# EAGLE design opaq_n1 (EAGLE 6.3)

## Sheet 1 of 2
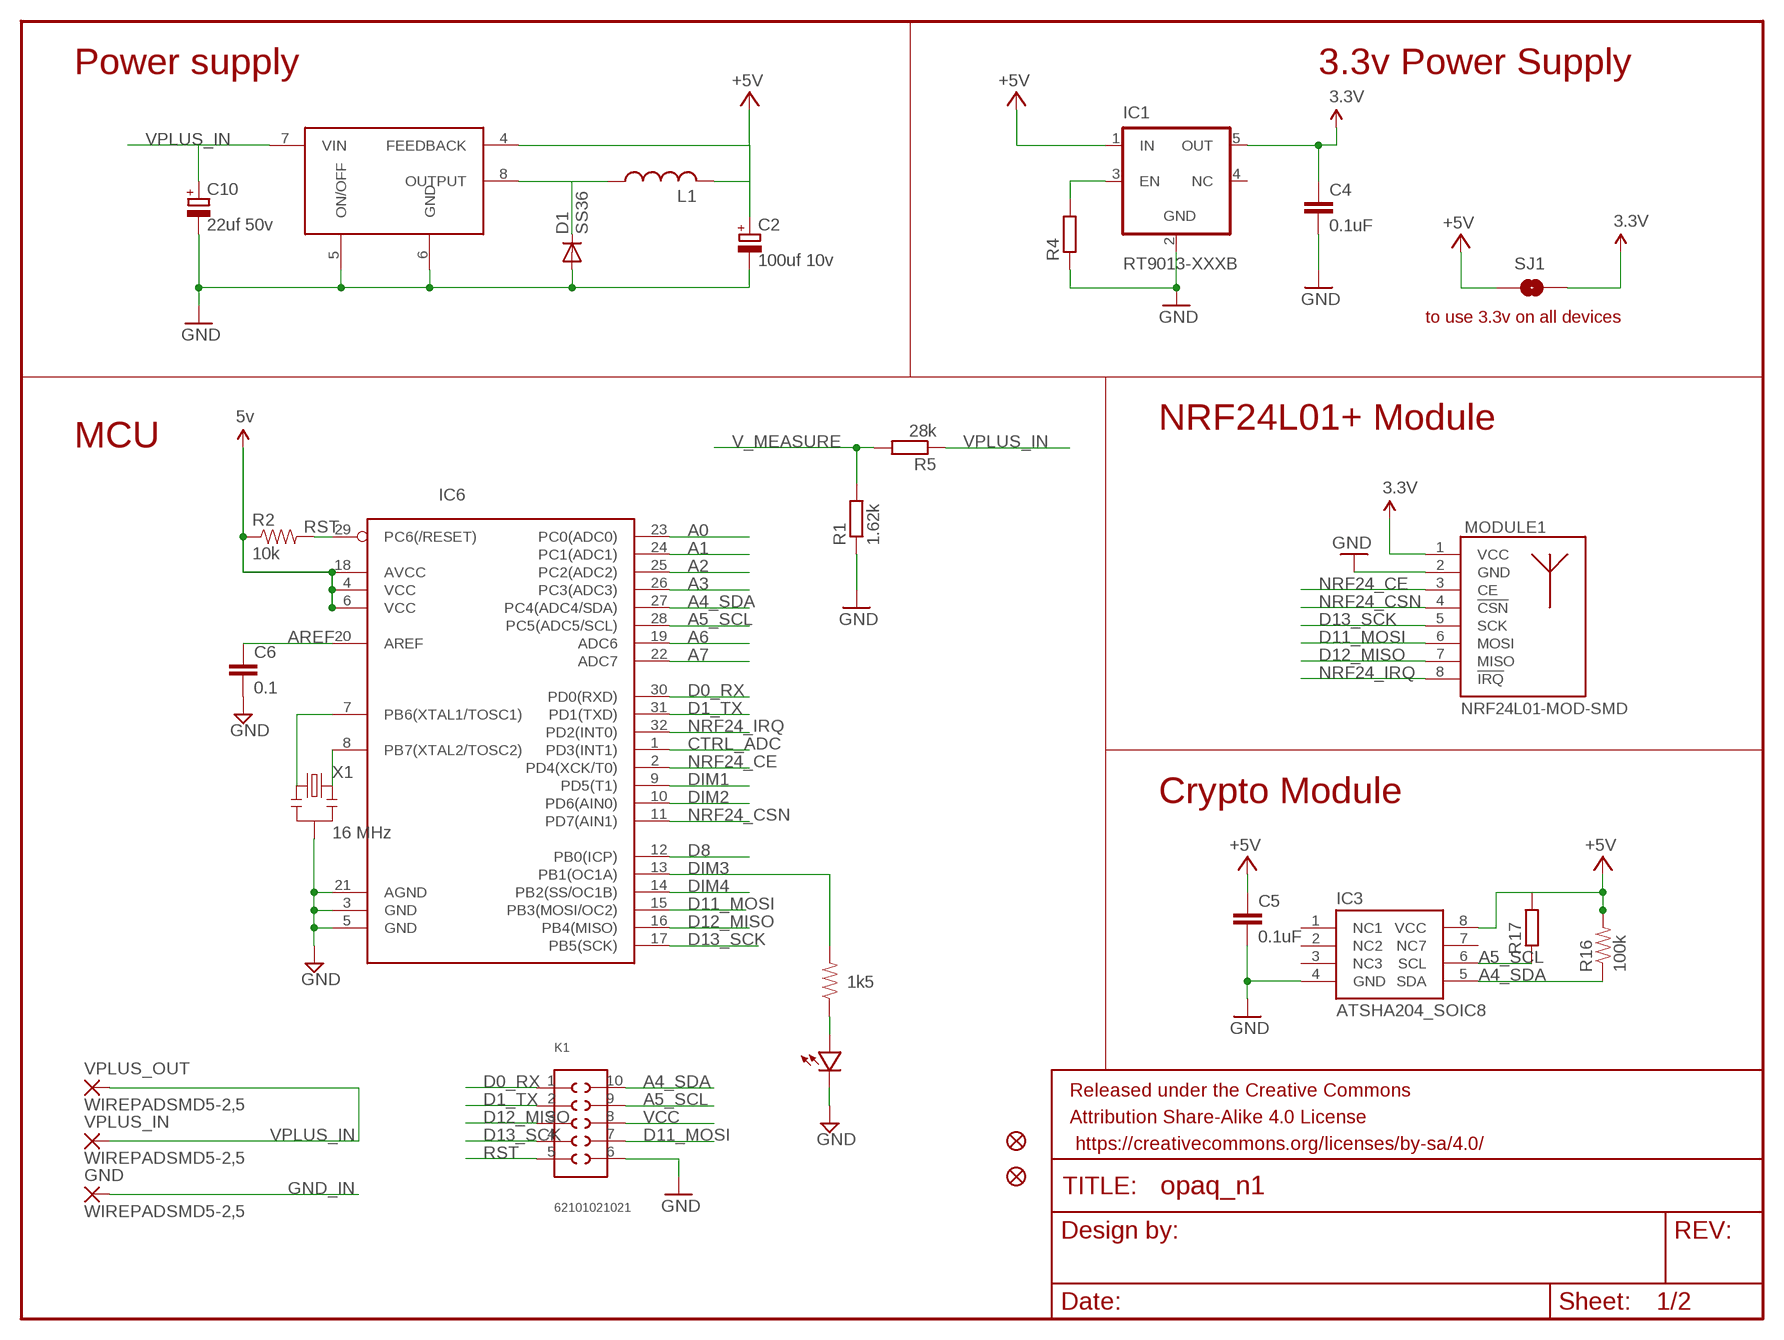
[diagram p0: schematic, sheet 1]

### Parts
C2  100uf 10v  CPOL-EUC/6032-28R  [C/6032-28R]
C4  0.1uF  CAP0805  [0805]
C5  0.1uF  CAP0805  [0805]
C6  0.1  CAP0603-CAP  [0603-CAP]
C10  22uf 50v  CPOL-EUD/7343-31R  [D/7343-31R]
D1  SS36  DIODESMA  [SMA-DIODE]
DIM  LED0603  [0603-LED]
FRAME1  FRAME-LETTER  [CREATIVE_COMMONS]
GND  WIREPADSMD5-2,5  [5-2,5]
IC1  RT9013-XXXB  [SOT23-5]
IC3  ATSHA204_SOIC8  [SOIC8]
IC6  ATMega-328  ATMEGA168/328MLF  [MLF32]
IC8  LM2594HV  LM2594  [SO08]
JP1  FIDUCIAL1X2.5  [FIDUCIAL-1X2.5]
JP2  FIDUCIAL1X2.5  [FIDUCIAL-1X2.5]
K1  62101021021  [62101021021]
L1  NR6045  [2525]
MODULE1  NRF24L01-MOD-SMD  [SMD8-MODULE]
R1  1.62k  R-EU_R0805  [0805]
R2  10k  RESISTOR0603-RES  [0603-RES]
R3  1k5  RESISTOR0603-RES  [0603-RES]
R4  R-EU_R0805  [0805]
R5  28k  R-EU_R0805  [0805]
R16  100k  RESISTOR0805-RES  [0805]
R17  R-EU_R0805  [0805]
SJ1  SOLDERJUMPERTRACE  [SJ_2S-TRACE]
VPLUS_IN  WIREPADSMD5-2,5  [5-2,5]
VPLUS_OUT  WIREPADSMD5-2,5  [5-2,5]
X1  16 MHz  RESONATORSMD  [RESONATOR-SMD]

### Nets
3.3V: C4.1 IC1.5(OUT) MODULE1.1(VCC) SJ1.2
+5V [power usb]: C2.+ C5.1 IC1.1(IN) IC3.8(VCC) IC8.4(FEEDBACK) L1.P$1 R16.2 R17.2 SJ1.1 ; also sheet 2
A0: IC6.23(PC0(ADC0))
A1: IC6.24(PC1(ADC1))
A2: IC6.25(PC2(ADC2))
A3: IC6.26(PC3(ADC3))
A4_SDA: IC3.5(SDA) IC6.27(PC4(ADC4/SDA)) K1.10 R16.1 ; also sheet 2
A5_SCL: IC3.6(SCL) IC6.28(PC5(ADC5/SCL)) K1.9 R17.1 ; also sheet 2
A6: IC6.19(ADC6)
A7: IC6.22(ADC7)
AREF: C6.1 IC6.20(AREF)
CTRL_ADC: IC6.1(PD3(INT1)) ; also sheet 2
D0_RX: IC6.30(PD0(RXD)) K1.1
D1_TX: IC6.31(PD1(TXD)) K1.2
D8: IC6.12(PB0(ICP)) ; also sheet 2
D11_MOSI: IC6.15(PB3(MOSI/OC2)) K1.7 MODULE1.6(MOSI) ; also sheet 2
D12_MISO: IC6.16(PB4(MISO)) K1.3 MODULE1.7(MISO) ; also sheet 2
D13_SCK: IC6.17(PB5(SCK)) K1.4 MODULE1.5(SCK) ; also sheet 2
DIM1: IC6.9(PD5(T1)) ; also sheet 2
DIM2: IC6.10(PD6(AIN0)) ; also sheet 2
DIM3: IC6.13(PB1(OC1A)) R3.2 ; also sheet 2
DIM4: IC6.14(PB2(SS/OC1B)) ; also sheet 2
GND: C2.- C4.2 C5.2 C6.2 C10.- D1.A DIM.MINUS IC1.2(GND) IC3.4(GND) IC6.3(GND) IC6.5(GND) IC6.21(AGND) IC8.5(ON/OFF) IC8.6(GND) K1.6 MODULE1.2(GND) R1.1 R4.1 X1.2 ; also sheet 2
GND_IN: GND.1(P) ; also sheet 2
N$1: IC6.7(PB6(XTAL1/TOSC1)) X1.1
N$2: DIM.PLUS R3.1
N$10: IC1.3(EN) R4.2
N$17: D1.C IC8.8(OUTPUT) L1.P$2
N$21: IC6.8(PB7(XTAL2/TOSC2)) X1.3
NRF24_CE: IC6.2(PD4(XCK/T0)) MODULE1.3(CE)
NRF24_CSN: IC6.11(PD7(AIN1)) MODULE1.4(!CSN)
NRF24_IRQ: IC6.32(PD2(INT0)) MODULE1.8(!IRQ)
RST: IC6.29(PC6(/RESET)) K1.5 R2.2
V_MEASURE: R1.2 R5.2 ; also sheet 2
VCC: IC6.4(VCC) IC6.6(VCC) IC6.18(AVCC) K1.8 R2.1 ; supply symbol labelled 5v ; also sheet 2
VPLUS_IN [power]: C10.+ IC8.7(VIN) R5.1 VPLUS_IN.1(P) VPLUS_OUT.1(P)
Unconnected: IC1.4(NC) IC3.1(NC1) IC3.2(NC2) IC3.3(NC3) IC3.7(NC7)

### Notes on the sheet
- Power supply | 3.3v Power Supply
- to use 3.3v on all devices
- NRF24L01+ Module
- MCU
- Crypto Module

## Sheet 2 of 2
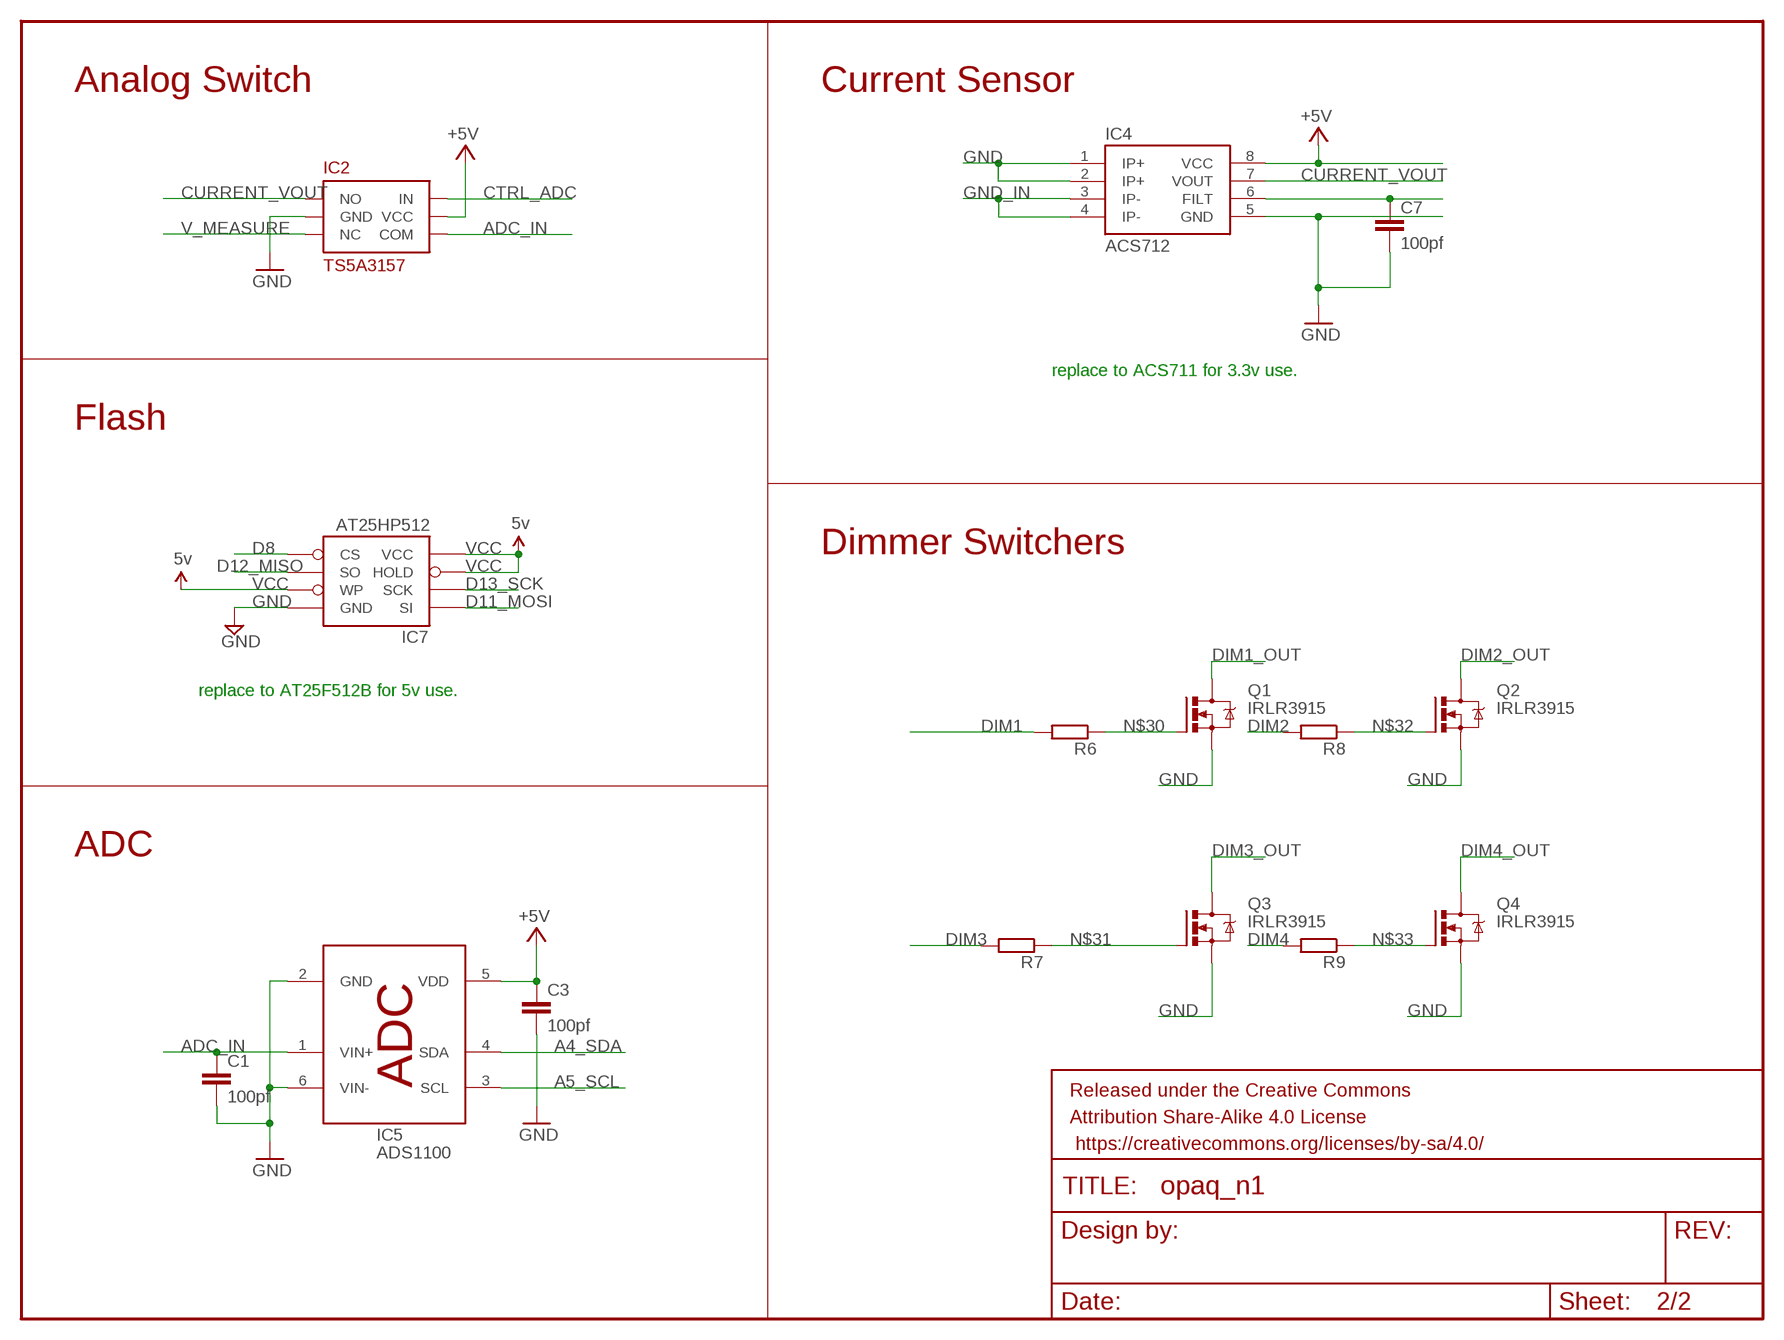
[diagram p1: schematic, sheet 2]

### Parts
C1  100pf  CAP0402-CAP  [0402-CAP]
C3  100pf  CAP0402-CAP  [0402-CAP]
C7  100pf  CAP0402-CAP  [0402-CAP]
FRAME2  FRAME-LETTERNO_PACKAGE  [DUMMY]
IC2  TS5A3157  [SOT23-6]
IC4  ACS712  [SO08]
IC5  ADS1100  [SOT23-6]
IC7  AT25HP512  AT25F512BWIDE_5.3MM  [SO08WIDE]
Q1  IRLR3915  [D-PAK_TO252AA]
Q2  IRLR3915  [D-PAK_TO252AA]
Q3  IRLR3915  [D-PAK_TO252AA]
Q4  IRLR3915  [D-PAK_TO252AA]
R6  R-EU_R0805  [0805]
R7  R-EU_R0805  [0805]
R8  R-EU_R0805  [0805]
R9  R-EU_R0805  [0805]

### Nets
+5V [power usb]: C3.1 IC2.5(VCC) IC4.8(VCC) IC5.5(VDD) ; also sheet 1
A4_SDA: IC5.4(SDA) ; also sheet 1
A5_SCL: IC5.3(SCL) ; also sheet 1
ADC_IN: C1.1 IC2.4(COM) IC5.1(VIN+)
CTRL_ADC: IC2.6(IN) ; also sheet 1
CURRENT_VOUT: IC2.1(NO) IC4.7(VOUT)
D8: IC7.1(CS) ; also sheet 1
D11_MOSI: IC7.5(SI) ; also sheet 1
D12_MISO: IC7.2(SO) ; also sheet 1
D13_SCK: IC7.6(SCK) ; also sheet 1
DIM1: R6.2 ; also sheet 1
DIM1_OUT: Q1.4(D)
DIM2: R8.2 ; also sheet 1
DIM2_OUT: Q2.4(D)
DIM3: R7.2 ; also sheet 1
DIM3_OUT: Q3.4(D)
DIM4: R9.2 ; also sheet 1
DIM4_OUT: Q4.4(D)
FILT: C7.1 IC4.6(FILT)
GND: C1.2 C3.2 C7.2 IC2.2(GND) IC4.1(IP+) IC4.2(IP+) IC4.5(GND) IC5.2(GND) IC5.6(VIN-) IC7.4(GND) Q1.3(S) Q2.3(S) Q3.3(S) Q4.3(S) ; also sheet 1
GND_IN: IC4.3(IP-) IC4.4(IP-) ; also sheet 1
N$30: Q1.1(G) R6.1
N$31: Q3.1(G) R7.1
N$32: Q2.1(G) R8.1
N$33: Q4.1(G) R9.1
V_MEASURE: IC2.3(NC) ; also sheet 1
VCC: IC7.3(WP) IC7.7(HOLD) IC7.8(VCC) ; supply symbol labelled 5v ; also sheet 1

### Notes on the sheet
- Analog Switch | Current Sensor
- replace to ACS711 for 3.3v use.
- Flash
- Dimmer Switchers
- replace to AT25F512B for 5v use.
- ADC

## Library data of the parts
C1 C3-C5 C7 = SparkFun-Passives:CAP: Capacitor Standard 0603 ceramic capacitor, and 0.1" leaded capacitor.
C2 C10 = rcl:CPOL-EU: POLARIZED CAPACITOR, European symbol
C6 = LowPowerLab:CAP: Capacitor Standard 0603 ceramic capacitor, and 0.1" leaded capacitor.
D1 = SparkFun:DIODE: Diode These are standard reverse protection diodes and small signal diodes. SMA package can handle up to about 1A. SOD-323 can handle about 200mA. What the SOD-323 package when ordering, there are some mfgs out there that are 5-pin packages.
DIM = LowPowerLab:LED
FRAME1 = SparkFun-Aesthetics:FRAME-LETTER: Schematic Frame Standard 8.5x11 US Letter frame
FRAME2 = SparkFun-Aesthetics:FRAME-LETTER: Schematic Frame Standard 8.5x11 US Letter frame; DESIGNER: Nobody; VERSION: v01
GND VPLUS_IN VPLUS_OUT = wirepad:WIREPAD: Wire PAD connect wire on PCB
IC1 = v-reg_extra:RT9013-XXX: LDO REGULATOR 500mA, Low Dropout, Low Noise Ultra-Fast without bypass capacitor CMOS LDO Regulator
IC2 = pimoroni:TS5A3157: TS5A3157: 10-Ω SPDT ANALOG SWITCH The TS5A3157 is a single-pole double-throw (SPDT) analog switch that is designed to operate from 1.65V to 5.5V. This device can handle both digital and analog signals, and signals up to V+ can be transmitted in either direction.
IC3 = SparkFun-DigitalIC:ATSHA204_SOIC8: ATSHA204; PROD_ID: IC-11981
IC4 = SparkFun:ACS712
IC5 = bytewerk-analog:ADS1100: 16-Bit ANALOG-TO-DIGITAL CONVERTER, I2C; MF: TI; MPN: ADS1100; OC_MOUSER: 595-ADS1100A1IDBVT
IC6 = LowPowerLab:ATMEGA168/328: Atmel 32-pin 8-bit micro, 16k flash.
IC7 = LowPowerLab:AT25F512B: 4-Mbit SPI flash memory
IC8 = apedro_lib:LM2594: 8-SOIC NMOSFET
JP1 JP2 = SparkFun:FIDUCIAL: Fiducial Alignment Points Various fiducial points for machine vision alignment.
K1 = Wurth_Elektronik_Electromechanic_Board_to_Board_Connectors_rev15c:62101021021: WR-PHD 1.27mm Dual SMT Pin Header H=3.80 mm, 10 Pins=>Code : Con_BTB_PHD_1.27_2_62101021021 <http://katalog.we-online.de/media/thumbs2/eican/thb_Con_BTB_PHD_1.27_2_6210xx21021_pf2.jpg> Details see: http://katalog.we-online.de/en/em/621_0xx_210_21 Created 2014-06-03, Karrer Zheng 2014 (C) Würth Elektronik
L1 = apedro_lib:NR6045
MODULE1 = nrf24l01:NRF24L01-MOD: NRF24L01 based module VCC = 1.9~3.6V
Q1-Q4 = apedro_lib:IRLR3915: N-Channel HEXFET® Power MOSFET Logic Level AUTOMOTIVE MOSFET Source: http://www.irf.com/product-info/datasheets/data/irlz44zpbf.pdf
R1 R4-R9 R17 = resistor:R-EU_: RESISTOR, European symbol
R2 R3 = LowPowerLab:RESISTOR: Resistor Basic schematic elements and footprints for 0603, 1206, and PTH resistors.
R16 = SparkFun-Passives:RESISTOR: Resistor Basic schematic elements and footprints for 0603, 1206, and PTH resistors.
SJ1 = SparkFun:SOLDERJUMPER: Solder Jumper Standard SMD solder jumper. Used to automate production. Two varients : Normally Open and Normally Closed are the same, but have different paste layers. NC will have a large amount of paste and should jumper during reflow.
X1 = SparkFun:RESONATOR: Resonator Small SMD resonator. This is the itty bitty 10/20MHz resonators with built in caps. CSTCE10M0G55 and CSTCE20M0V53. Footprint has been reviewed closely but hasn't been tested yet.

## Net classes
1 power: width 0.381 mm, clearance 0.254 mm
2 gnd: width 0.305 mm, drill 0.406 mm, clearance 0.203 mm
3 power usb: width 0.508 mm, drill 0.406 mm, clearance 0.203 mm

## Board
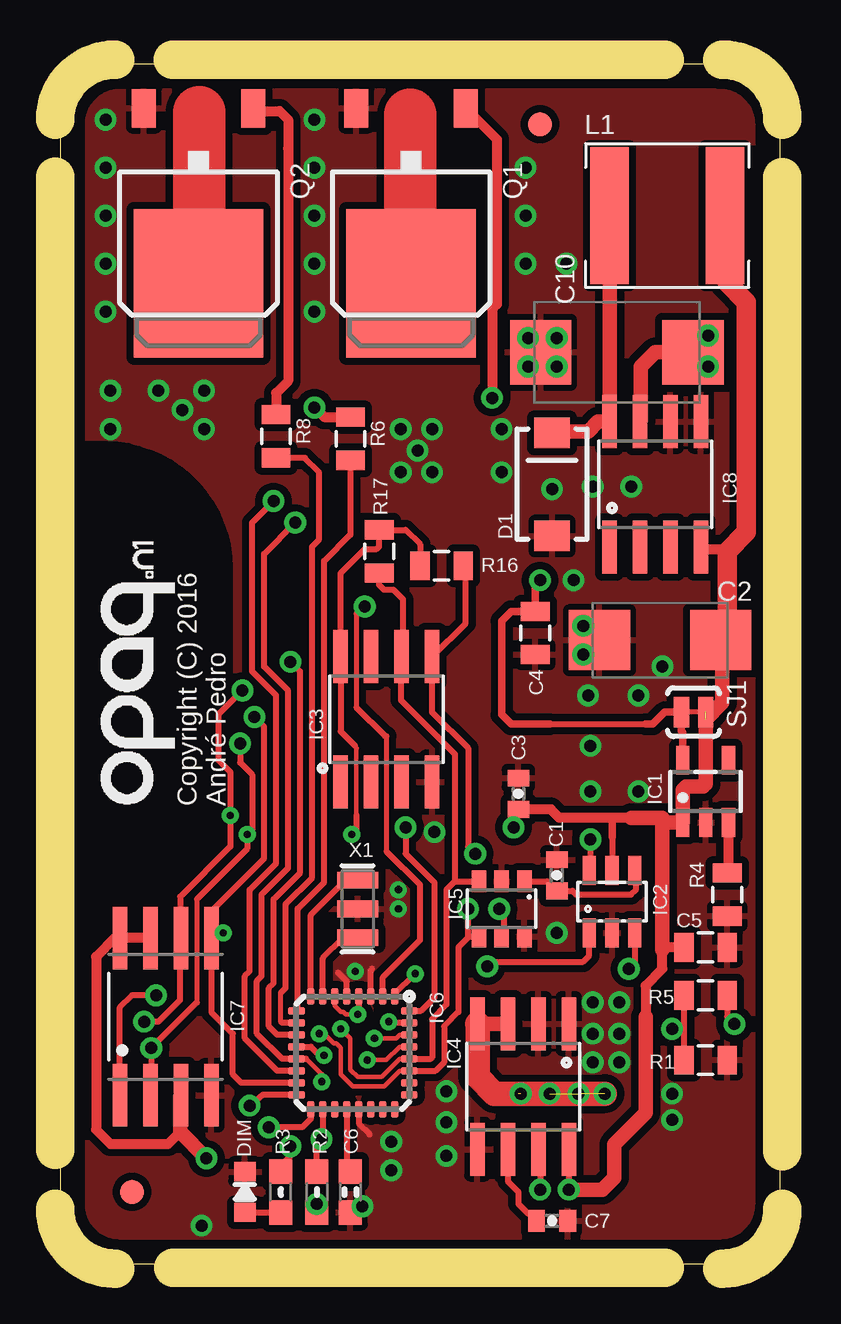
[diagram p2: board, top side]
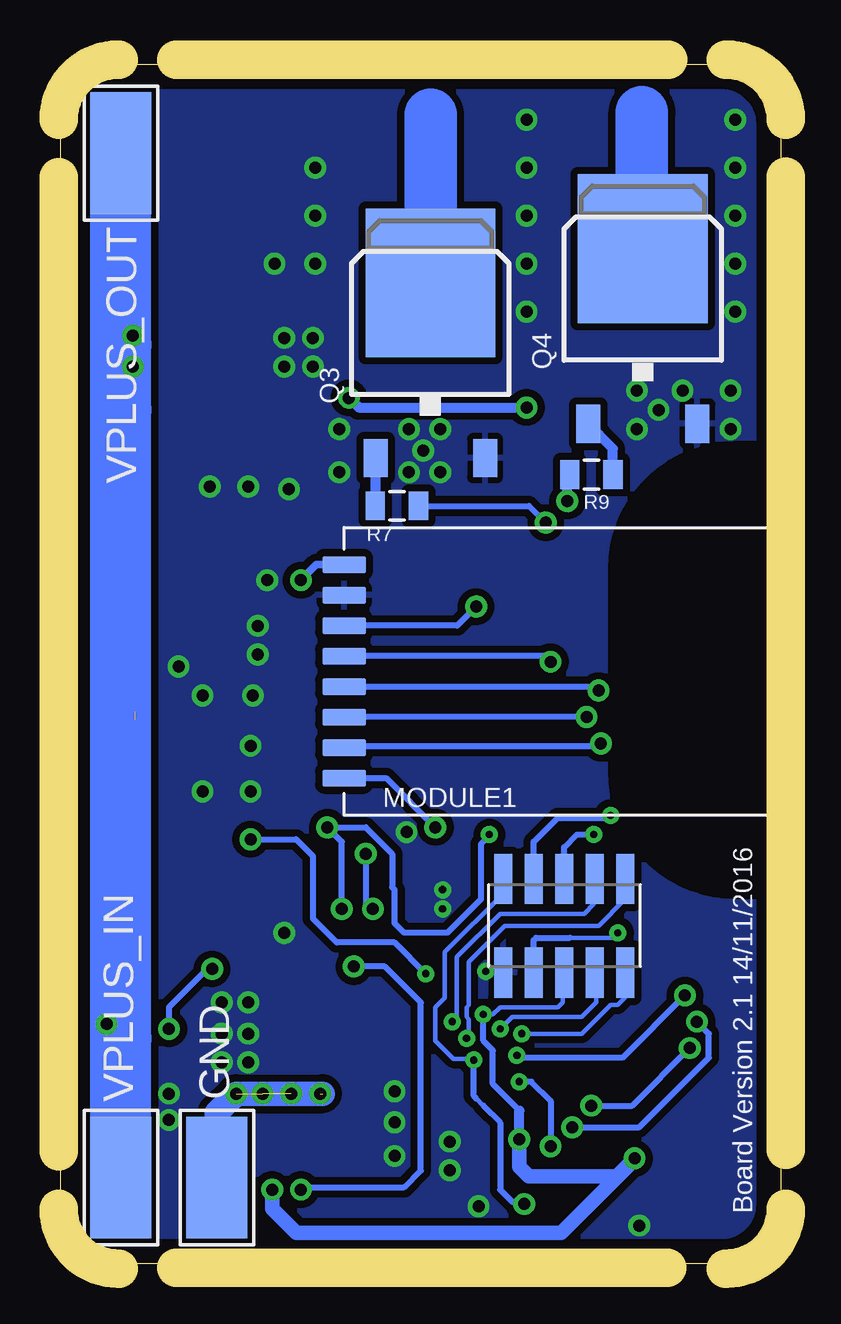
[diagram p3: board, bottom side, seen from below]

Size 30 x 50 mm. Coordinates in mm from the lower left corner, seen from the top.
Outline: 27.5,50 2.5,50 arc90 0,47.5 0,2.5 arc90 2.5,0 27.5,0 arc90 30,2.5 30,47.5 arc90 27.5,50
Copper layers (1*16): Top 0.035mm / dielectric 1.5mm / Bottom 0.035mm
Design rules "default *": minimum track width 10mil, minimum drill 6mil, track to track 7mil, track to pad 7mil, pad to pad 7mil, via to via 7mil, smd to smd 7mil, copper to edge 40mil, drill to drill 8mil, minimum pad ring 10mil, minimum via ring 8mil, stop-mask expansion 4mil, vias tented up to drill 0mil, thermal gap 10mil
tRestrict: area 0,15.5 to 6.9,34
bRestrict: area 0,15.5 to 6.9,34
Milling: 8 lines

### Footprints (pad centres in the part's own frame; a part is rotated, then mirrored left to right if it is on the bottom)
0402-CAP = smd 0.7 x 0.9: 1 -0.65,0; 2 0.65,0
C/6032-28R = smd 2.55 x 2.5: + 2.525,0; - -2.525,0
0805 = smd 0.8 x 1.2: 1 -0.9,0; 2 0.9,0
0603-CAP = smd 1.016 x 0.965: 1 -0.85,0; 2 0.85,0
D/7343-31R = smd 2.55 x 2.7: + 3.175,0; - -3.175,0
SMA-DIODE = smd 1.27 x 1.47: A -2.15,0; C 2.15,0
0603-LED = smd 0.8 x 0.9: MINUS -0.85,0; PLUS 0.85,0
5-2,5 = smd 2.54 x 5.08: 1 0,0
SOT23-5 = smd 0.55 x 1.2: 1 -0.95,-1.3; 2 0,-1.3; 3 0.95,-1.3; 4 0.95,1.3; 5 -0.95,1.3
SOT23-6 = smd 0.55 x 1.2: 1 -0.95,-1.3; 2 0,-1.3; 3 0.95,-1.3; 4 0.95,1.3; 5 0,1.3; 6 -0.95,1.3
SOIC8 = smd 0.61 x 2.21: 1 -1.905,-2.616; 2 -0.635,-2.616; 3 0.635,-2.616; 4 1.905,-2.616; 5 1.905,2.616; 6 0.635,2.616; 7 -0.635,2.616; 8 -1.905,2.616
SO08 = smd 0.61 x 2.21: 1 -1.905,-2.616; 2 -0.635,-2.616; 3 0.635,-2.616; 4 1.905,-2.616; 5 1.905,2.616; 6 0.635,2.616; 7 -0.635,2.616; 8 -1.905,2.616
SOT23-6' = smd 0.6 x 0.9: 1 -0.95,-1.15; 2 0,-1.15; 3 0.95,-1.15; 4 0.95,1.15; 5 0,1.15; 6 -0.95,1.15
MLF32 = smd 0.7 x 0.3: 1 -2.35,1.75; 2 -2.35,1.25; 3 -2.35,0.75; 4 -2.35,0.25; 5 -2.35,-0.25; 6 -2.35,-0.75; 7 -2.35,-1.25; 8 -2.35,-1.75; 17 2.35,-1.75; 18 2.35,-1.25; 19 2.35,-0.75; 20 2.35,-0.25; 21 2.35,0.25; 22 2.35,0.75; 23 2.35,1.25; 24 2.35,1.75 | smd 0.3 x 0.7: 9 -1.75,-2.35; 10 -1.25,-2.35; 11 -0.75,-2.35; 12 -0.25,-2.35; 13 0.25,-2.35; 14 0.75,-2.35; 15 1.25,-2.35; 16 1.75,-2.35; 25 1.75,2.35; 26 1.25,2.35; 27 0.75,2.35; 28 0.25,2.35; 29 -0.25,2.35; 30 -0.75,2.35; 31 -1.25,2.35; 32 -1.75,2.35
SO08WIDE = smd 0.61 x 2.6: 1 -1.905,-3.269; 2 -0.635,-3.269; 3 0.635,-3.269; 4 1.905,-3.269; 5 1.905,3.286; 6 0.635,3.286; 7 -0.635,3.286; 8 -1.905,3.286
FIDUCIAL-1X2.5 = smd 1 x 1: 1 0,0
62101021021 = smd 0.75 x 2.1: 1 -1.905,-1.95; 2 -0.635,-1.95; 3 0.635,-1.95; 4 1.905,-1.95; 5 3.175,-1.95; 6 3.175,1.95; 7 1.905,1.95; 8 0.635,1.95; 9 -0.635,1.95; 10 -1.905,1.95
2525 = smd 1.6 x 5.7: P$1 2.4,0; P$2 -2.4,0
SMD8-MODULE = smd 0.7 x 1.8: 1 -4.445,0; 2 -3.175,0; 3 -1.905,0; 4 -0.635,0; 5 0.635,0; 6 1.905,0; 7 3.175,0; 8 4.445,0
D-PAK_TO252AA = smd 1 x 1.6: 1 -2.28,-4.8; 3 2.28,-4.8 | smd 5.4 x 6.2: 4 0,2.5
0603-RES = smd 1.016 x 0.965: 1 -0.85,0; 2 0.85,0
SJ_2S-TRACE = smd 0.635 x 1.27: 1 -0.508,0; 2 0.508,0
RESONATOR-SMD = smd 0.7 x 1.7: 1 -1.2,0; 2 0,0; 3 1.2,0

### Placement (x,y rotation side)
C1  20.7,16.2 90 top
C2  25,26 0 top
C3  19.1,19.6 90 top
C4  19.8,26.3 270 top
C5  26.9,13.2 0 top
C6  12.1,3 270 top
C7  20.5,1.8 0 top
C10  23.2,38 0 top
D1  20.5,32.5 90 top
DIM  7.7,3 270 top
FRAME1  -19.51,-10.12 0 top  (outside the outline)
FRAME2  -19.51,-10.12 0 top  (outside the outline)
GND  23.5,3.6 0 bottom
IC1  26.9,19.7 0 top
IC2  23,15.1 0 top
IC3  13.6,22.7 0 top
IC4  19.3,7.4 180 top
IC5  ADS1100  [SOT23-6']  18.4,14.8 180 top
IC6  12.2,8.8 270 top
IC7  4.4,10.3 0 top
IC8  24.8,32.5 0 top
JP1  3,3 0 top
JP2  20,47.5 0 top
K1  8.4,14.1 180 bottom
L1  25.3,43.7 0 top
MODULE1  18.2,24.7 270 bottom
Q1  14.63,43.37 180 top
Q2  5.77,43.37 180 top
Q3  14.61,38.39 0 bottom
Q4  5.76,39.82 0 bottom
R1  26.9,8.5 180 top
R2  10.7,3 270 top
R3  9.2,3 90 top
R4  27.8,15.4 90 top
R5  26.9,11.2 180 top
R6  12.1,34.4 270 top
R7  16,31.6 0 bottom
R8  9,34.5 270 top
R9  7.9,32.9 180 bottom
R16  15.9,29.1 180 top
R17  13.3,29.7 90 top
SJ1  26.4,23 180 top
VPLUS_IN  27.5,3.6 0 bottom
VPLUS_OUT  27.5,46.3 0 bottom
X1  12.4,14.8 90 top

### Tracks (layer width: path | path; a pad name or v marks a point on that pad's centre or on a via)
3.3V  (via drill 0.5)
  Top 0.254: 20.4,22.5 24.4,22.5
  Top 0.305: IC1.5 25.95,22.15 25.89,22.21 SJ1.2 25.2,23 24.7,22.5 24.4,22.5 | 20.4,22.5 18.8,22.5 18.4,22.9 18.4,26.8 18.8,27.2 C4.1 19.8,28.3 v20,28.5
  Bottom 0.305: MODULE1.1 19.36,29.14 v20,28.5
+5V  (via drill 0.3, 0.5)  (1 unrouted)
  Top 0.178: 12.35,21.5 12.35,18.7
  Top 0.2: 12.3,21.6 12.35,21.5
  Top 0.254: IC5.5 18.5,13.75 18.5,14.6 v18.3,14.8 | 23,17.8 IC2.5 | IC4.8 v21.2,3.1 | 18.9,18.75 C3.1 | R16.2 15,30 14.4,30.6 R17.2 13.3,29.9 13.2,29.8 12.7,29.8 11.7,28.8 IC3.8 11.7,22.2 12.3,21.6 | 12.35,18.7 12.35,18.1 v12.15,17.9
  Top 0.305: 23,17.8 23,18.57 22.97,18.6
  Top 0.406: C3.1 20.45,18.95 20.8,18.6 22.97,18.6 23.8,18.6 | C5.1 25.2,13.2 25.1,13.1 25.1,12.3 24.4,11.6 24.4,10.3 | v18.9,18.2 18.9,18.75 | IC8.4 26.79,29.8 27.7,29.8 27.8,29.7 | 26.8,19.9 26.9,20 | 27.6,25.93 C2.+
  Top 0.61: v21.2,3.1 22.6,3.1 23.08,3.58 23.08,4.98 24.4,6.3 24.4,10.3 | 24.9,18.6 25.1,18.6 25.1,13.1 | 24.9,18.6 23.8,18.6 | 26.8,19.9 26.1,19.9 25.95,19.75 IC1.1 25.1,18.4 24.9,18.6 | 26.9,20 26.9,22.7 27.6,23.4 27.6,25.93
  Top 0.813: L1.P$1 27.8,43.6 27.8,40.9 28.6,40.1 28.6,30.5 27.8,29.7 27.8,26.27 C2.+
  Bottom 0.254: v18.3,14.8 18.3,17.6 v18.9,18.2 | 18.6,17.9 v18.9,18.2 | v18.9,18.2 17.3,18.2 16.2,17.1 16.2,15.7 16.1,15.6 16.1,14.2 15.7,13.8 13.9,13.8 12.5,15.2 12.5,17.5 12.15,17.85 v12.15,17.9
  Bottom 0.61: v21.2,3.1 21.2,2.3 20.2,1.3 9.15,1.3 6.08,4.37
A4_SDA  (via drill 0.3, 0.5)
  Top 0.178: IC6.27 14.15,8.05 13.5,7.4 12.2,7.4 11.7,7.9 11.7,9 11.5,9.2 11.4,9.2 11,9.6 v10.8,9.6
  Top 0.254: 17.05,13.65 16.6,13.2 16.6,10.5 16,9.9 16,8.4 15.65,8.05 IC6.27 | 17.05,13.65 IC5.4 | 17.05,13.65 17,13.7 v17,14.8 | R16.1 16.7,29 16.9,28.8 16.9,26.7 15.52,25.32 IC3.5 15.51,23 17,21.5 17,17.4 v17.3,17.1
  Bottom 0.178: K1.10 6.5,11.1 6.8,10.8 7.1,10.8 8.3,9.6 v10.8,9.6
  Bottom 0.254: v17.3,17.1 17.3,14.9 v17,14.8
A5_SCL  (via drill 0.3)
  Top 0.178: IC6.28 14.15,8.55 13.4,7.8 12.4,7.8 12.1,8.1 12.1,9.4 v11.7,9.8
  Top 0.254: 16.45,15.95 16.1,15.6 16.1,10.8 15.5,10.2 15.5,8.6 15.45,8.55 IC6.28 | 16.45,15.95 IC5.3 | 16.45,15.95 16.45,21.25 14.2,23.5 14.2,25.28 IC3.6 14.3,25.38 14.3,27.7 13.9,28.1 13.5,28.1 13.3,28.3 R17.1
  Bottom 0.178: K1.9 7.7,12.09 7.7,10.9 8.3,10.3 11.2,10.3 v11.7,9.8
ADC_IN
  Top 0.254: IC5.1 20.3,15.95 C1.1 21.35,15.55 21.5,15.4 23.8,15.4 24,15.6 24,16.35 IC2.4
AREF
  Top 0.254: IC6.20 11.95,4 C6.1
CTRL_ADC  (via drill 0.3, 0.5)
  Top 0.254: v22.1,17.7 22.1,16.45 IC2.6 | IC6.1 13.95,11.25 v14.8,12.1
  Bottom 0.254: v22.1,17.7 20.2,17.7 19.5,17 19.5,14.4 18.5,13.4 16.1,13.4 v14.8,12.1
CURRENT_VOUT  (via drill 0.5)
  Top 0.254: IC4.7 20,4.72 v20,3.1 | v17.8,12.4 17.9,12.6 21.8,12.6 22.05,12.85 IC2.1
  Bottom 0.254: v20,3.1 19.9,3.2 15.7,3.2 15,3.9 15,10.9 16.5,12.4 v17.8,12.4
D0_RX  (via drill 0.3)
  Top 0.178: v13.1,9.4 14,9.4 14.15,9.55 IC6.30
  Bottom 0.178: K1.1 6.5,15.2 7.6,14.1 11.5,14.1 13,12.6 13,10.8 13.1,10.7 13.1,10.3 13,10.2 13,9.5
  Bottom 0.254: K1.1 | 13,9.5 v13.1,9.4
D1_TX  (via drill 0.3)
  Top 0.254: IC6.31 13.95,10.05 v13.7,10.1
  Bottom 0.178: v13.7,10.1 13.5,10.3 13.5,12.8 11.7,14.6 8.2,14.6 7.8,15 7.8,16.02
  Bottom 0.254: 7.8,16.02 K1.2
D8  (via drill 0.3, 0.5)
  Top 0.254: IC7.1 2.5,10.7 3,11.2 v4,11.2 | IC6.12 10.45,9.05 10.9,8.6 v11,8.7
  Bottom 0.254: v4,11.2 6.6,8.6 10.9,8.6 v11,8.7
D11_MOSI  (via drill 0.3, 0.5)
  Top 0.178: v6.8,13.8 IC7.5
  Top 0.254: IC6.15 7.55,7.55 7.2,7.9 7.2,9.6 6.3,10.49 IC7.5 6.3,14.71 8.5,16.9 8.5,22.4 v8.1,22.8
  Bottom 0.178: 8.8,13.6 7,13.6 v6.8,13.8
  Bottom 0.254: v8.1,22.8 MODULE1.6 | K1.7 10.3,13.49 10.2,13.6 8.8,13.6
D12_MISO  (via drill 0.3, 0.5)
  Top 0.2: 5.7,15.2 5.7,10.9
  Top 0.254: IC6.16 8.45,7.05 v7.9,6.6 | IC7.2 3.8,7.07 v3.8,9 5.7,10.9 | v7.5,21.7 7.5,20.9 8,20.4 8,18.1 v7.8,17.9 7.8,17.3 5.7,15.2
  Bottom 0.254: MODULE1.7 18.12,21.6 7.6,21.6 v7.5,21.7 7.5,21.65 | v7.9,6.6 6.2,6.6 v3.8,9 | K1.3 9.04,17.36 8.5,17.9 v7.8,17.9
D13_SCK  (via drill 0.3, 0.5)
  Top 0.254: IC6.17 10.45,6.05 10.1,5.7 v8.7,5.7 | v7.6,23.9 6.6,22.9 6.6,21 7.1,20.5 7.1,19 v7.1,18.7 7.1,17.4 5,15.3 5,13.62 IC7.6 5,13.55 5,11 4.1,10.1 v3.5,10.1
  Bottom 0.254: v8.7,5.7 5.9,5.7 3,8.6 3,9.6 v3.5,10.1 | MODULE1.5 7.76,24.07 v7.6,23.9 | K1.4 10.3,17.59 9.3,18.6 7.2,18.6 v7.1,18.7
DIM1
  Top 0.254: IC6.9 9.9,10.6 9.9,14.8 11,15.9 11,29.3 12.1,30.4 R6.2
DIM2
  Top 0.2: 9.2,10.1 9.2,11.3
  Top 0.254: IC6.10 9.25,10.05 9.2,10.1 | 9.2,11.3 9.4,11.5 9.4,15 10.5,16.1 10.5,29.9 10.8,30.2 10.8,33 10.2,33.6 R8.2
DIM3  (via drill 0.3, 0.5)
  Top 0.178: 10.25,8.55 10.9,7.9
  Top 0.254: 9.6,30.7 v9.8,30.9 8.5,29.6 8.5,24.9 9.5,23.9 9.5,16.5 8.4,15.4 8.4,12 8.2,11.8 8.2,9.6 9.25,8.55 IC6.13 10.25,8.55 | R3.2 9.2,4.1 9.6,4.5 v9.6,4.9 | 10.9,7.9 v10.9,7.6
  Bottom 0.254: v10.9,7.6 10.4,7.6 9.6,6.8 v9.6,4.9 | v9.8,30.9 10.5,31.6 R7.2
DIM4  (via drill 0.5)
  Top 0.254: 8.6,31.8 v8.9,31.8 8,30.9 8,24.7 9,23.7 9,16.7 7.9,15.6 7.9,12.2 7.7,12 7.7,9.4 9.05,8.05 IC6.14
  Bottom 0.406: v8.9,31.8 8.9,32.8 R9.2
FILT
  Top 0.254: IC4.6 18.66,3.44 19.1,3 19.1,2.5 19.5,2.1 20.05,2.1 C7.1
GND  (via drill 0.3, 0.5)
  Top 0.254: IC6.21 12.45,5.85 12.9,5.4 | IC6.5 11.95,11.78 K1.6 | IC6.3 12.95,12.25 13,12.3
  other vias: 1.9,39.7 1.9,41.7 1.9,43.7 1.9,45.7 1.9,47.7 10.6,39.7 10.6,41.7 10.6,43.7 10.6,45.7 10.6,47.7 21.4,28.5 19.4,41.7 19.4,43.7 19.4,45.7 21.1,41.7 5.9,1.6 15.6,18 12.3,12.2 20.7,13.8 22.2,8.4 23.3,10.9 23.3,9.6 23.3,8.4 22.2,10.9 22.2,9.6 24.1,19.7 22.1,19.7 22.1,21.6 24.1,23.7 22,23.7 14.1,14.8 5.1,35.6 6,34.8 2.1,34.8 14.2,34.8 14.2,33 25.5,6 25.5,7.1 25.1,24.9 21.8,25.4 21.8,26.6 16.1,4.5 16.1,5.9 13.8,5.1 13.8,3.9 18.4,34.8 18.4,33 20.5,32.3 22.2,32.4 23.8,32.4 19.5,38.6 19.5,37.4 20.7,38.6 20.7,37.4 15.5,34.8 15.5,33 14.9,33.9 6,36.4 4.1,36.4 2.1,36.4 12.6,2.4 16.1,7.2 14.1,15.6
  pour Top (isolate 0.305): 0,50 30,50 30,0 0,0
  pour Bottom (isolate 0.305): 0,50 30,50 30,0 0,0
GND_IN  (via drill 0.5)  (3 unrouted)
  Top 0.61: IC4.4 IC4.3
  Top 1.016: IC4.4 17.4,7.8 18.1,7.1 v22.7,7.1
  Bottom 1.016: GND.1 23.5,6.3 v22.7,7.1 19.1,7.1
  other vias: 21.6,7.1 20.4,7.1 19.2,7.1
N$1
  Top 0.254: IC6.7 10.95,12.75 11.8,13.6 X1.1
N$2
  Top 0.254: DIM.PLUS R3.1
N$6
  Top 2.184: 5.8,43.4 5.8,48
N$7
  Top 2.184: 14.6,43.3 14.6,47.9
N$8
  Bottom 2.184: 5.8,43.3 5.8,48
N$9
  Bottom 2.184: 14.6,43.4 14.6,47.9
N$10
  Top 0.406: IC1.3 27.85,16.35 R4.2
N$17
  Top 0.61: D1.C 20.75,34.7 22,34.7 22.42,35.12 IC8.8 L1.P$2
N$21
  Top 0.254: IC6.8 10.45,14.55 11.9,16 X1.3
N$30  (via drill 0.5)
  Top 0.406: Q1.1 18.2,46.88 18.2,40 18,39.8 v18,36.1 | v10.6,35.7 11,35.3 R6.1
  Bottom 0.406: v18,36.1 17.6,35.7 v10.6,35.7
N$31
  Bottom 0.305: 17,33.59 16.9,33.49
  Bottom 0.406: Q3.1 17,33.59 | 16.9,33.49 R7.1
N$32
  Top 0.406: Q2.1 8.05,48.05 9.15,48.05 9.5,47.7 9.5,46.5 9.5,36.8 9,36.3 R8.1
N$33
  Bottom 0.406: R9.1 7,33.98 Q4.1
NRF24_CE  (via drill 0.5)
  Top 0.2: 12.35,27.1 12.35,23.2 | 13.6,22 13.6,17.2
  Top 0.254: 13.6,17.2 15,15.8 15,13.5 13.45,11.95 IC6.2 | v12.7,27.4 12.35,27.1 | 13.6,22 13.55,22 12.35,23.2
  Bottom 0.254: v12.7,27.4 13.49,26.61 MODULE1.3
NRF24_CSN  (via drill 0.5)
  Top 0.254: IC6.11 9.05,9.55 8.7,9.9 8.7,11.5 8.9,11.7 8.9,15.2 10,16.3 10,24.7 v9.6,25.1
  Bottom 0.254: 18.07,25.2 MODULE1.4 9.84,25.34 v9.6,25.1
NRF24_IRQ  (via drill 0.5)
  Top 0.254: v14.4,18.2 14.4,17.1 15.6,15.9 15.6,11.1 15.05,10.55 IC6.32
  Bottom 0.254: MODULE1.8 16.45,20.25 v14.4,18.2
RST  (via drill 0.3, 0.5)
  Top 0.178: IC6.29 14.15,9.05 13.6,8.5 v12.8,8.5
  Top 0.254: R2.2 v10.7,2.5
  Bottom 0.178: 11.57,15.53 11.57,15.43 14,13 14,11.1 14.4,10.7 14.4,9.6 14.4,9.3 13.65,8.55 12.85,8.55 | 12.7,6.9 12.4,6.6
  Bottom 0.254: 12.4,6.6 11.7,5.9 11.7,3.1 11.2,2.6 v10.7,2.5 | K1.5 11.57,15.53 | 12.7,6.9 12.8,7 v12.8,8.5 12.85,8.55
V_MEASURE  (via drill 0.5)
  Top 0.254: R1.2 26,9.9 | 26,9.9 R5.2 | v25.5,9.8 25.9,9.8 26,9.9 | IC2.3 23.95,12.55 v23.7,12.3
  Bottom 0.254: v25.5,9.8 25.5,10.7 23.9,12.3 v23.7,12.3
VCC  (via drill 0.3, 0.5)
  Top 0.178: v12.4,10.4 11.9,10.4 11.8,10.5 11.7,10.5 11.45,10.75 IC6.6
  Top 0.254: R2.1 10.7,5 v10.9,5.2 10.95,5.25 IC6.18 | IC6.4 12.45,10.35 v12.4,10.4
  Top 0.406: IC7.8 IC7.7 2.29,13.59 1.5,12.8 1.5,5.6 2.1,5 4.5,5 5,5.5 | 5,7 IC7.3
  Top 0.61: 5,7 5,5.5 v6.1,4.4
  Bottom 0.178: K1.8 9.1,12.09 9.1,10.9 9.3,10.7 11.7,10.7 12,10.4 v12.4,10.4
  Bottom 0.254: 10.9,6.4 12,7.5 12,8.9 12.4,9.3 v12.4,10.4
  Bottom 0.406: v10.9,5.2 10.9,6.4
  Bottom 0.61: v10.9,5.2 10.9,4.05 10.5,3.65 6.85,3.65 v6.1,4.4
VPLUS_IN  (via drill 0.5)
  Top 0.254: R5.1 27.8,10.3 v28.1,10
  Top 0.406: IC8.7 24.2,35.08
  Top 0.61: IC8.7 24.2,35.15 24.2,37.4 24.8,38 C10.+ 26.4,38 | 26.4,38 v27,37.4 | 26.4,38 26.4,38.1 v27,38.7
  Bottom 0.254: 27.5,9.4 v28.1,10 28.1,9.5 27.7,9.1
  Bottom 0.406: 26.7,32.7 27.5,35.7 27.5,35.6
  Bottom 0.61: v27,38.7 27.1,38.7 27.5,38.3
  Bottom 2.54: VPLUS_IN.1 27.5,9.4 27.5,35.6 27.5,38.3 VPLUS_OUT.1

### Text on the board
tPlace: Copyright (C) 2016 / André Pedro
bNames: Board Version 2.1 14/11/2016
tDocu: André Pedro